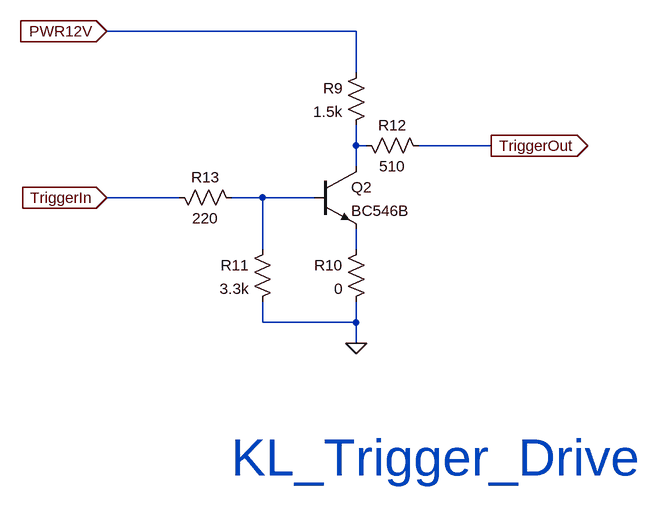
[diagram p0: schematic dme_analog_KLR_Trigger.asc]
dme_analog_KLR_Trigger.asc, the LTspice schematic file:
Version 4
SHEET 1 4356 3824
WIRE 816 2624 432 2624
WIRE 816 2688 816 2624
WIRE 816 2800 816 2768
WIRE 832 2800 816 2800
WIRE 1024 2800 912 2800
WIRE 816 2832 816 2800
WIRE 544 2880 432 2880
WIRE 672 2880 624 2880
WIRE 752 2880 672 2880
WIRE 672 2960 672 2880
WIRE 816 2960 816 2928
WIRE 672 3072 672 3040
WIRE 816 3072 816 3040
WIRE 816 3072 672 3072
WIRE 816 3104 816 3072
FLAG 816 3104 0
FLAG 432 2880 TriggerIn
IOPIN 432 2880 In
FLAG 1024 2800 TriggerOut
IOPIN 1024 2800 Out
FLAG 432 2624 PWR12V
IOPIN 432 2624 In
SYMBOL npn 752 2832 R0
SYMATTR InstName Q2
SYMATTR Value BC546B
SYMBOL Res 832 2672 M0
SYMATTR InstName R9
SYMATTR Value 1.5k
SYMBOL Res 832 2944 M0
SYMATTR InstName R10
SYMATTR Value 0
SYMBOL Res 688 2944 M0
SYMATTR InstName R11
SYMATTR Value 3.3k
SYMBOL Res 528 2864 M90
WINDOW 0 0 56 VBottom 2
WINDOW 3 32 56 VTop 2
SYMATTR InstName R13
SYMATTR Value 220
SYMBOL Res 816 2784 M90
WINDOW 0 0 56 VBottom 2
WINDOW 3 32 56 VTop 2
SYMATTR InstName R12
SYMATTR Value 510
TEXT 624 3280 Left 6 ;KL_Trigger_Drive

The netlist it stands for:
* dme_analog_KLR_Trigger.asc
Q2 N001 N002 N003 0 BC546B
R9 PWR12V N001 1.5k
R10 N003 0 0
R11 N002 0 3.3k
R13 TriggerIn N002 220
R12 N001 TriggerOut 510
.model NPN NPN
.model PNP PNP
.lib standard.bjt
* KL_Trigger_Drive
.backanno
.end